# Altium schematic sheet crw_comm.SchDoc
size A
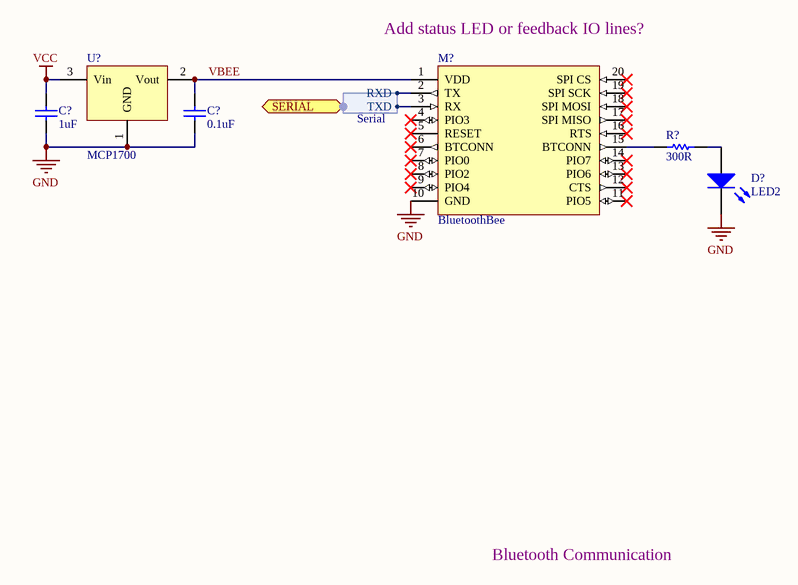
[diagram p0: crw_comm.SchDoc]

## Parts
(Parts that share a designator on the sheet are numbered #1, #2 ... from top to bottom, then left to right.)
C?#1  value 1uF  [0805]  (hidden comment: C0805)
C?#2  value 0.1uF  [0805]  (hidden comment: C0805)
D?  LED2  [3.2X1.6X1.1]
M?  BluetoothBee  [XBee]
R?  value 300R  [2012[0805]]  (hidden comment: Res Semi)
U?  MCP1700  [SO-G3]

## Ports
SERIAL (harness Serial)

## Harnesses
Serial: RXD, TXD

## Nets
GND: C?#1.2 C?#2.2 D?.2(K) M?.10(GND) U?.1(GND)
VCC: C?#1.1 U?.3(Vin)
VBEE: C?#2.1 M?.1(VDD) U?.2(Vout)
NetD?_1: D?.1(A) R?.2
NetM?_2: M?.2(TX) ; port SERIAL.RXD
NetM?_3: M?.3(RX) ; port SERIAL.TXD
NetM?_15: M?.15(BTCONN) R?.1

Not connected (* = marked no-connect by the designer): M? 4(PIO3)* 5(RESET)* 6(BTCONN)* 7(PIO0)* 8(PIO2)* 9(PIO4)* 11(PIO5)* 12(CTS)* 13(PIO6)* 14(PIO7)* 16(RTS)* 17(SPI_MISO)* 18(SPI_MOSI)* 19(SPI_SCK)* 20(SPI_CS)*

## Notes on the sheet
- (near M?) Add status LED or feedback IO lines?
- Bluetooth Communication

## Library data of the parts
C?#1 C?#2 = C0805: Ceramic Chip Capacitor - Standard; Note: Footprint corresponds to dimensions for bulk cassette packaging. This case size has tightened tolerances.; Published: 17-Jul-2002; LatestRevisionDate: 19-Mar-2004; LatestRevisionNote: Silkscreen size reduced.; DatasheetDocument: Mar-2001; PackageDocument: Mar-2001; PackageReference: 0805; Publisher: Altium Limited; Code_JEITA: 0805; Code_IPC: 2012[0805]; ComponentLink1Description: Manufacturer Link; ComponentLink1URL: http://www.kemet.com/; ComponentLink2Description: Datasheet; ComponentLink2URL: http://www.kemet.com/kemet/web/homepage/kechome.nsf/vapubfilesname/F3102TA.pdf/$file/F3102TA.pdf
D? = LED2: Typical RED, GREEN, YELLOW, AMBER GaAs LED; Published: 8-Jun-2000; LatestRevisionDate: 17-Jul-2002; LatestRevisionNote: Re-released for DXP Platform.; PackageDocument: Feb-2002; PackageReference: 3.2X1.6X1.1; Publisher: Altium Limited
M? = DFBluetoothBee: DFRobot Bluetooth Bee Wireless Module
R? = Res Semi: Semiconductor Resistor; Published: 8-Jun-2000; LatestRevisionDate: 17-Jul-2002; LatestRevisionNote: Re-released for DXP Platform.; PackageReference: AXIAL-0.5; Publisher: Altium Limited
U? = MCP1702: 2 uA Low Dropout Positive Voltage Regulator